# EAGLE schematic Adafruit GPS Logger Shield (EAGLE 9.0.1)
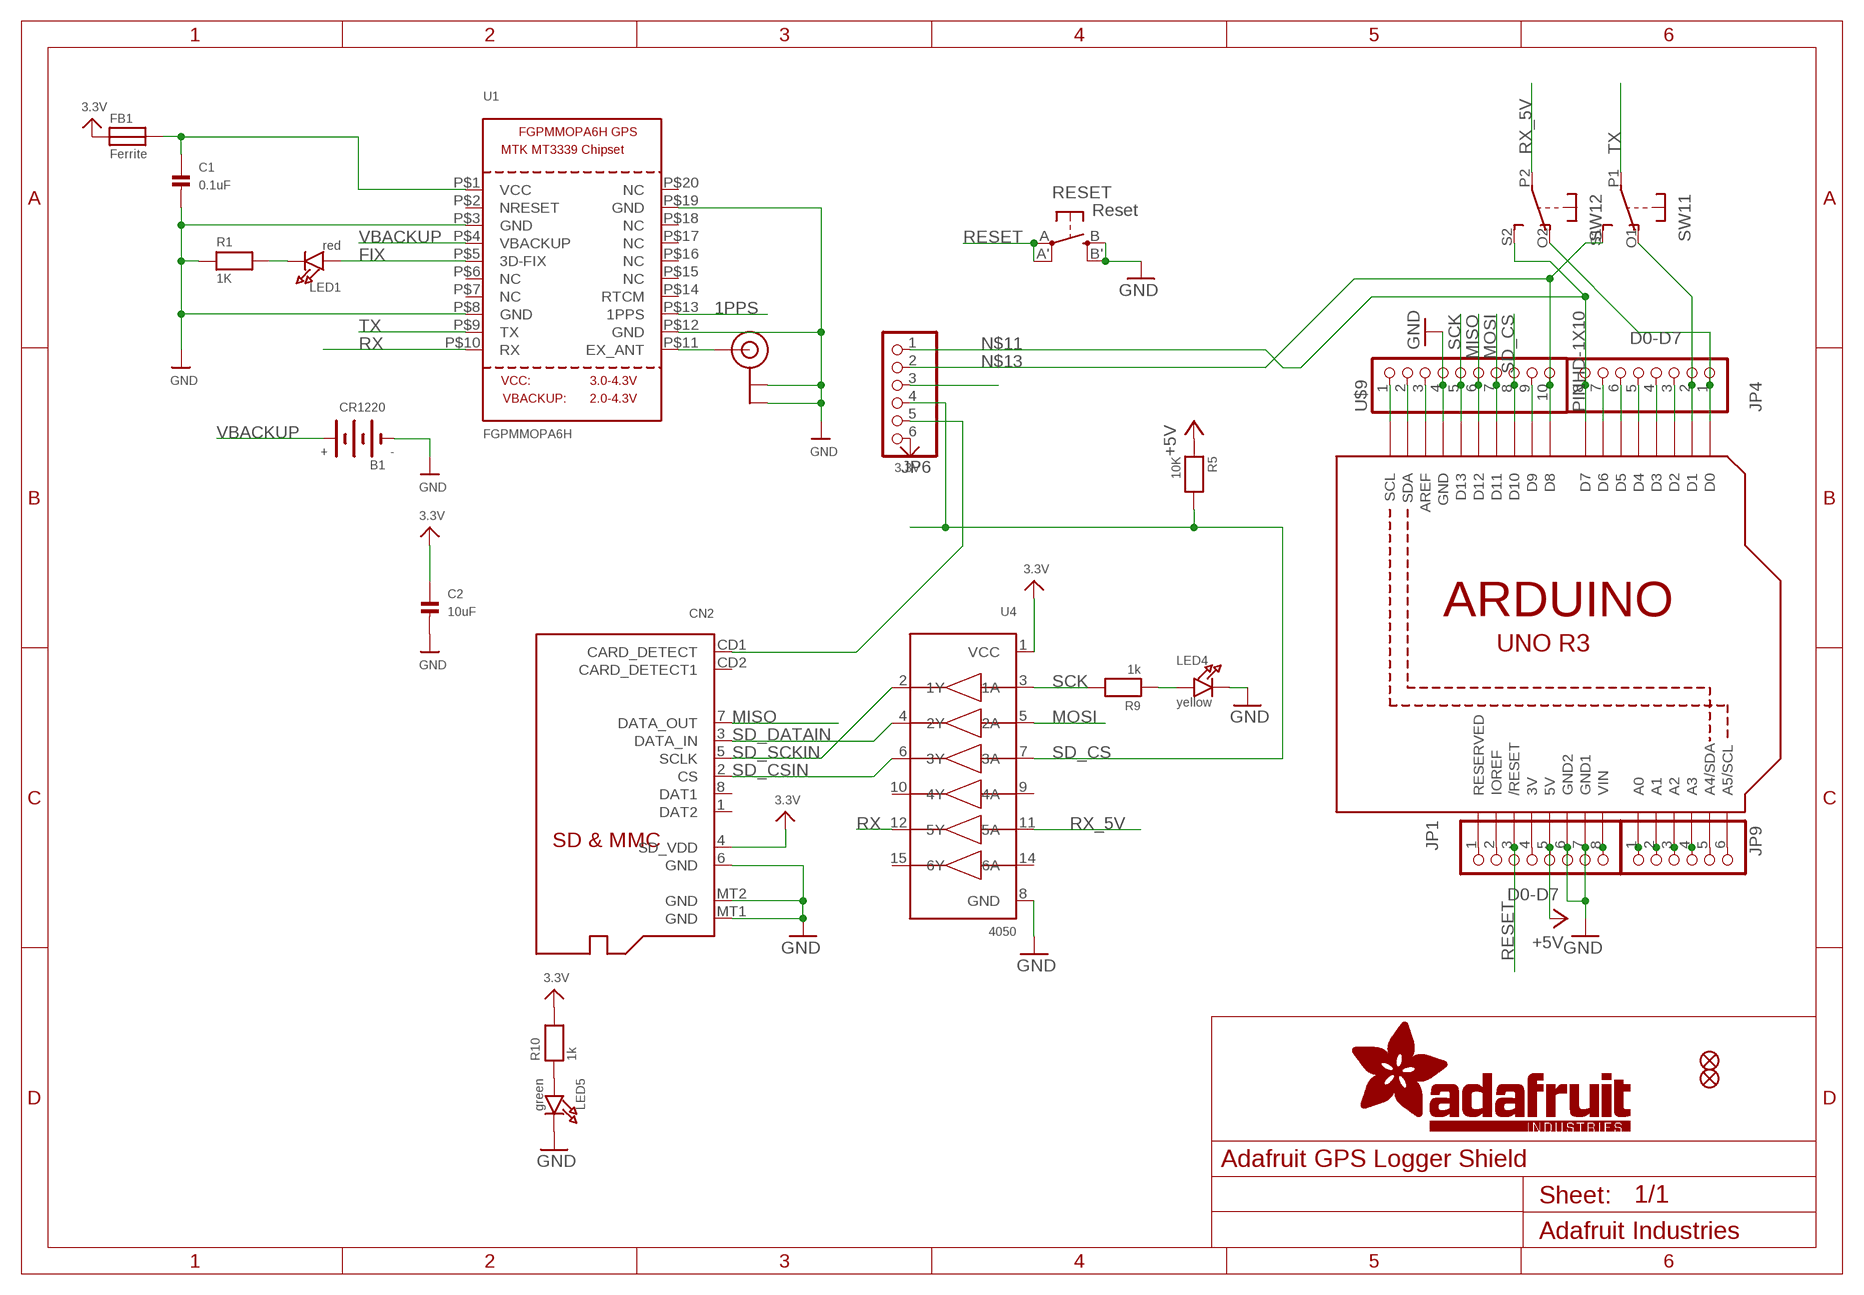
[diagram p0: schematic, sheet 1]

## Parts
B1  CR1220  BATTERYCR1220_SMT  [CR1220]
C1  0.1uF  CAP_CERAMIC0805  [0805@1]
C2  10uF  CAP_CERAMIC0805  [0805@1]
CN2  MICROSD  [MICROSD]
FB1  Ferrite  FERRITE0805  [0805@1]
FID1  FIDUCIAL""  [FIDUCIAL_1MM]
FID2  FIDUCIAL""  [FIDUCIAL_1MM]
JP1  D0-D7  PINHD-1X8BIG  [1X08-BIG]
JP4  D0-D7  PINHD-1X8BIG  [1X08-BIG]
JP6  PINHD-1X6B  [1X06-BIG]
JP9  PINHD-1X6B  [1X06-BIG]
LED1  red  LED0805  [CHIPLED_0805]
LED4  yellow  LED0805  [CHIPLED_0805]
LED5  green  LED0805  [CHIPLED_0805]
R1  1K  RESISTOR0805  [0805]
R5  10K  RESISTOR0805  [0805]
R9  1k  RESISTOR0805  [0805]
R10  1k  RESISTOR0805  [0805]
RESET  Reset  SPST_TACT-EVQQ2  [EVQ-Q2]
SW1  DPDT-EG1390  [EG1390]
U1  FGPMMOPA6H  GPS_FGPMMOPA6H  [FGPMMOPA6H]
U3  ARDUINOR3-DIMENSION  [ARDUINOR3]
U4  4050  74HC4050D  [SOIC16]
U$9  PINHD-1X10  [1X10-BIG]
U$20  U.FL  [U.FL]

## Nets
1PPS: JP6.3 U1.P$13(1PPS)
3.3V: C2.1 CN2.4(SD_VDD) FB1.1 JP6.6 R10.2 U4.1(VCC)
+5V: JP1.5 R5.1 U3.5V
FIX: LED1.A U1.P$5(3D-FIX)
GND: B1.- C1.2 C2.2 CN2.6(GND) CN2.MT1(GND) CN2.MT2(GND) JP1.6 JP1.7 LED4.C LED5.C R1.1 RESET.B'(S1) RESET.B(S) U1.P$3(GND) U1.P$8(GND) U1.P$12(GND) U1.P$19(GND) U3.GND U3.GND1 U3.GND2 U4.8(GND) U$9.4 U$20.P$1(GND) U$20.P$2(GND)
MISO: CN2.7(DATA_OUT) U3.D12 U$9.6
MOSI: U3.D11 U4.5(2A) U$9.7
N$1: C1.1 FB1.2 U1.P$1(VCC)
N$2: LED1.C R1.2
N$3: JP1.1 U3.RESERVED
N$4: U1.P$11(EX_ANT) U$20.P$3(SIGNAL)
N$5: JP1.2 U3.IOREF
N$6: JP1.4 U3.3V
N$7: U3.SCL U$9.1
N$8: LED4.A R9.1
N$9: JP9.6 U3.A5(A5/SCL)
N$10: JP9.5 U3.A4(A4/SDA)
N$11: JP4.8 JP6.1 SW1.S2(2:S) U3.D7
N$12: U3.SDA U$9.2
N$13: JP6.2 SW1.S1(1:S) U3.D8 U$9.10
N$14: JP4.2 SW1.O1(1:O) U3.D1
N$15: JP1.8 U3.VIN
N$89: JP4.3 U3.D2
N$90: JP4.4 U3.D3
N$98: JP4.5 U3.D4
N$99: JP4.6 U3.D5
N$100: JP4.7 U3.D6
N$108: U3.AREF U$9.3
N$110: U3.D9 U$9.9
N$150: LED5.A R10.1
N$154: JP9.1 U3.A0
N$164: JP9.2 U3.A1
N$181: JP9.3 U3.A2
N$182: JP9.4 U3.A3
N$201: JP4.1 SW1.O2(2:O) U3.D0
RESET: JP1.3 RESET.A'(P1) RESET.A(P) U3.RESET(/RESET)
RX: U1.P$10(RX) U4.12(5Y)
RX_5V: SW1.P2(2:P) U4.11(5A)
SCK: R9.2 U3.D13 U4.3(1A) U$9.5
SD_CD: CN2.CD1(CARD_DETECT) JP6.5
SD_CS: JP6.4 R5.2 U3.D10 U4.7(3A) U$9.8
SD_CSIN: CN2.2(CS) U4.6(3Y)
SD_DATAIN: CN2.3(DATA_IN) U4.4(2Y)
SD_SCKIN: CN2.5(SCLK) U4.2(1Y)
TX: SW1.P1(1:P) U1.P$9(TX)
VBACKUP: B1.+$1(+) U1.P$4(VBACKUP)
Unconnected: CN2.1(DAT2) CN2.8(DAT1) CN2.CD2(CARD_DETECT1) U1.P$2(NRESET) U1.P$6(NC) U1.P$7(NC) U1.P$14(RTCM) U1.P$15(NC) U1.P$16(NC) U1.P$17(NC) U1.P$18(NC) U1.P$20(NC) U4.9(4A) U4.10(4Y) U4.14(6A) U4.15(6Y)

## Library data of the parts
B1 = microbuilder:BATTERY
C1 C2 = microbuilder:CAP_CERAMIC: Ceramic Capacitors 0402 - 0402 Surface Mount Capacitors 16pF 50V 5% [Digikey: 445-4899-2-ND] 18pF 50V 5% [Digikey: 490-1281-2-ND] 22pF 50V 5% [Digikey: 490-1283-2-ND] 68pF 50V 5% [Digikey: 490-1289-2-ND] 0.1uF 10V 10% [Digikey: 490-1318-2-ND] 1.0uF 6.3V 10% [Digikey: 490-1320-2-ND] 0603 - 0603 Surface Mount Capacitors 16 pF 50V 5% [Digikey: 445-5051-2-ND] 22 pF 50V [Digikey: PCC220ACVTR-ND] 33 pF 50V 5% [Digikey: 490-1415-1-ND] 56pF 50V 5% [Digikey: 490-1421-1-ND] 220pF 50V 5% [Digikey: 445-1285-1-ND] 680 pF 50V 2200 pF 50V 5% C0G [Digikey: 445-1297-1-ND] 5600 pF 100V 5% X7R [Digikey: 478-3711-1-ND] 0.1 µF 25V 10% [Digikey: PCC2277TR-ND] 0.22 µF 16V 10% X7R [Digikey: 445-1318-1-ND] 1.0 µF 25V 10% [Digikey: 445-5146-2-ND] 0603 - RF Specific 3pF 250V +/-0.1pF RF [Digikey: 712-1347-1-ND] 18 pF 250V 5% [Digikey: 478-3505-1-ND or 712-1322-1-ND] 56 pF 250V 5% C0G RF [Digikey: 490-4867-1-ND] 68 pF 250V RF [Digikey: 490-4868-1-ND] 0805 - 0805 Surface Mount Capacitors 220 pF 250V 2% RF Ceramic Capacitor [Digikey: 712-1398-1-ND] 1000 pF 50V 2% NP0 Ceramic Capacitor [Digikey: 478-3760-1-ND] 0.1 µF 25V 10% Ceramic Capacitor [Digikey: PCC1828TR-ND] 1.0 µF 16V 10% Ceramic Capacitor[Digikey: 490-1691-2-ND] 10.0 µF 10V 10% Ceramic Capacitor[Digikey: 709-1228-1-ND] 10.0 uF 16V 10% Ceramic Capacitor [Digikey: 478-5165-2-ND] 47 uF 6.3V 20% Ceramic Capacitor [Digikey: 587-1779-1-ND or 399-5506-1-ND] 1206 - 1206 Surface Mount Capacitors 47uF 10V 20% Ceramic Capacitor [Digikey: 490-5528-1-ND or 399-5508-1-ND or 445-6010-1-ND] 100uF 6.3V -20%, +80% Y5V Ceramic Capacitor (Digikey: 490-4512-1-ND, Mouser: 81-GRM31CF50J107ZE1L)
CN2 = microbuilder:MICROSD: MicroSD/Transflash Card Holder with SPI pinout 3M: 2908-05WB-MG 4UConnector: 19656 Footprint courtesy: Adafruit Industries
FB1 = microbuilder:FERRITE: Ferrite Bead 0603 MMZ1608B121C - 120 Ohm, 600mA Ferrite Chip - Digikey: 445-2164-1-ND BK1608HW121-T - 120 Ohm, 600mA Ferrite Chip - Digikey: 587-1876-2-ND
FID1 FID2 = microbuilder:FIDUCIAL: Fiducial Alignment Points Various fiducial points for machine vision alignment.
JP1 JP4 = adafruit:PINHD-1X8: PIN HEADER
JP6 JP9 = adafruit:PINHD-1X6: PIN HEADER
LED1 LED4 LED5 = microbuilder:LED: LED 0603 - 0603 Surface Mount Package 2mA: Green LED - Low Power (3.9mcd, 2ma, 1.7Vf) - Digikey: 475-2709-2-ND Orange LED - Low Power (9.8mcd, 2ma, 1.8Vf) - Digikey: 475-1194-2-ND Red LED - Low Power (5mcd, 2ma, 1.8Vf) - Digikey: 475-1195-2-ND Yellow LED - Low Power (7mcd, 2ma, 1.8Vf) - Digikey: 475-1196-2-ND 5mA: Blue LED - Low Power (17mcd, 5ma, 2.9Vf) - Digikey: LNJ937W8CRACT-ND 0805 - 0805 Surface Mount Package 2mA: Red LED (8.8mcd, 2mA, 1.8Vf, Clear) - Low Power [Digikey: 475-2510-1-ND] Green LED (5mcd, 2mA, 1.8Vf, Clear) - Low Power [Digikey: 475-2730-1-ND] Yellow LED (11.3mcd, 2mA, 1.8Vf, Clear) - Low Power [Digikey: 475-2555-1-ND] 20mA: Red LED (104mcd, 20mA, Diffused) - LS R976 [Digikey: 475-1278-6-ND] Red LED (12mcd, 20mA, 2.0Vf, Clear) - APT2012EC [Digikey: 754-1128-1-ND] Green LED (15mcd, 20mA, 2.2Vf, Clear) - APT2012GC [Digikey: 754-1131-1-ND] Orange LED (160mcd, 20mA, 2.1Vf, Clear) - APT2012SECK [Digikey: 754-1130-1-ND] 1206 - 1206 Surface Mount Package Green LED (26mcd, 20mA, Diffused) - LG N971 [Digikey: 475-1407-6-ND] Red LED (15mcd, 20mA, Diffused) - LH N974 [Digikey: 475-1416-6-ND]
R1 R5 R9 R10 = microbuilder:RESISTOR: Resistors 0402 - 0402 Surface Mount Package 22 Ohm 1% 1/16W [Digikey: 311-22.0LRTR-ND] 33 Ohm 5% 1/16W 1.0K 5% 1/16W 1.5K 5% 1/16W 2.0K 1% 1/16W 10.0K 1% 1/16W [Digikey: 311-10.0KLRTR-ND] 10.0K 5% 1/16W [Digikey: RMCF0402JT10K0TR-ND] 12.1K 1% 1/16W [Digikey: 311-22.0LRTR-ND] 100.0K 5% 1/16W 0603 - 0603 Surface Mount Package 0 Ohm 1/10 Watt 1% Resistor 15 Ohm 1/10 Watt 1% Resistor 33 Ohm 1/10 Watt 1% Resistor 49.9 Ohm 1/10 Watt 1% Resistor 100 Ohm 1/10 Watt 1% Resistor 150 Ohm 1/10 Watt 1% Resistor 240 Ohm 1/10 Watt 1% Resistor 390 Ohm 1/10 Watt 1% Resistor 560 Ohm 1/10 Watt 1% Resistor 680 Ohm 1/10 Watt 1% Resistor 750 Ohm 1/10 Watt 1% Resistor 1.0K Ohm 1/10 Watt 1% Resistor 1.5K Ohm 1/10 Watt 1% Resistor 2.0K Ohm 1/10 Watt 1% Resistor 2.2K Ohm 1/10 Watt 1% Resistor 3.3K Ohm 1/10 Watt 1% Resistor 4.7K Ohm 1/10 Watt 1% Resistor 10.0K Ohm 1/10 Watt 1% Resistor 12.0K Ohm 1/10 Watt 1% Resistor 12.1K Ohm 1/10 Watt 1% Resistor 20.0K Ohm 1/10 Watt 1% Resistor 33.0K Ohm 1/10 Watt 1% Resistor 100.0K Ohm 1/10 Watt 1% Resistor 0805 - 0805 Surface Mount Package 0 Ohm 1/8 Watt 1% Resistor 33 Ohm 1/8 Watt 1% Resistor 100 Ohm 1/8 Watt 1% Resistor 150 Ohm 1/8 Watt 1% Resistor 200 Ohm 1/8 Watt 1% Resistor 240 Ohm 1/8 Watt 1% Resistor 330 Ohm 1/8 Watt 1% Resistor 390 Ohm 1/8 Watt 1% Resistor 470 Ohm 1/8 Watt 1% Resistor 1.0K Ohm 1/8 Watt 1% Resistor 1.5K Ohm 1/8 Watt 1% Resistor 2.0K Ohm 1/8 Watt 1% Resistor 4.7K Ohm 1/8 Watt 1% Resistor 5.1K Ohm 1/8 Watt 1% Resistor 5.6K Ohm 1/8 Watt 1% Resistor 10.0K Ohm 1/8 Watt 1% Resistor 22.0K Ohm 1/8 Watt 1% Resistor 33.0K Ohm 1/8 Watt 1% Resistor 100K Ohm 1/8 Watt 1% Resistor 1206 - 1206 Surface Mount Package 2012 - 2010 Surface Mount Package 0.11 Ohm 1/2 Watt 1% Resistor - Digikey: RHM.11UCT-ND
RESET = adafruit:SPST_TACT: SMT 6mm switch, EVQQ2 series http://www.ladyada.net/library/eagle
SW1 = adafruit:DPDT
U1 = microbuilder:GPS_FGPMMOPA6H: GPS Module - MTK MT3339 Chipset, -165dBm sensitivity, 22 channels, 10Hz, auto-select external antenna options
U3 = adafruit:ARDUINOR3: This is a new object for the new Arduino R3 - with extra pins that you may want to use (such as IOref, and duplicated A4/A5
U4 = microbuilder:74HC4050D: 6-channel level shifter 74HC4050D - 2V-6V Supply Digikey: 74HC4050D,653-ND Mouser: 771-74HC4050D-T
U$9 = adafruit:PINHD-1X10: Pin header 1x10 0.1" spacing With round pins
U$20 = microbuilder:U.FL: U.FL Antenna Connector